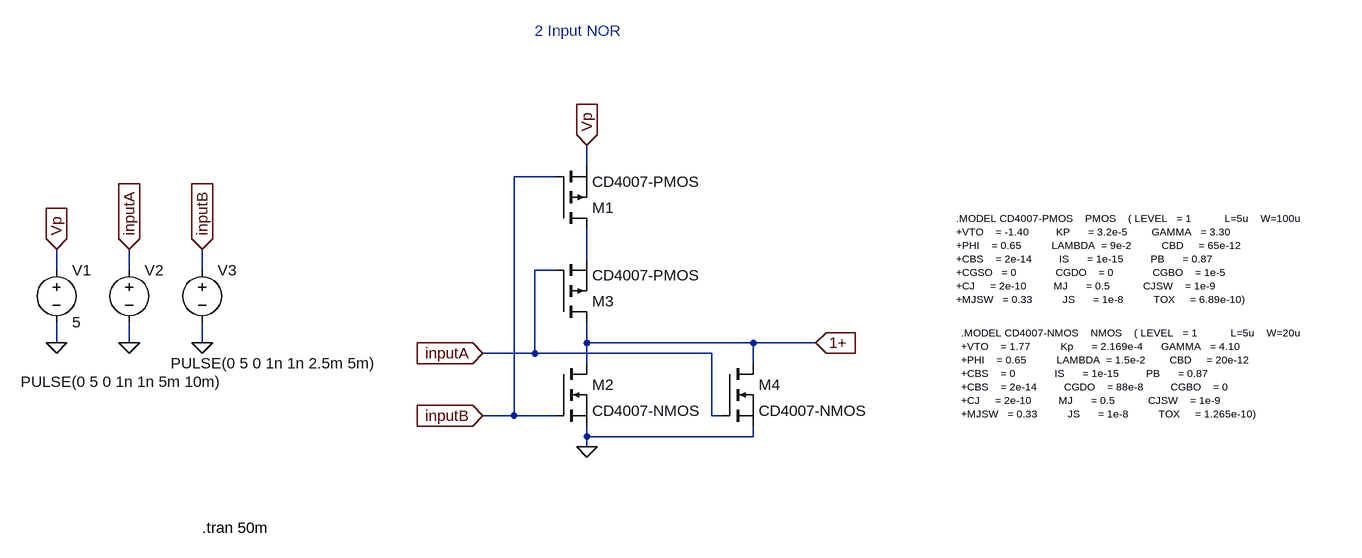
[diagram p0: schematic two_in_nor_ltspice.asc]
two_in_nor_ltspice.asc, the LTspice schematic file:
Version 4
SHEET 1 1176 680
WIRE -800 -128 -800 -160
WIRE -848 -112 -912 -112
WIRE -800 16 -800 -32
WIRE -1616 32 -1616 0
WIRE -1504 32 -1504 0
WIRE -1392 32 -1392 0
WIRE -848 32 -880 32
WIRE -1616 144 -1616 112
WIRE -1504 144 -1504 112
WIRE -1392 144 -1392 112
WIRE -800 144 -800 112
WIRE -544 144 -800 144
WIRE -448 144 -544 144
WIRE -880 160 -880 32
WIRE -880 160 -960 160
WIRE -608 160 -880 160
WIRE -800 176 -800 144
WIRE -544 176 -544 144
WIRE -912 256 -912 -112
WIRE -912 256 -960 256
WIRE -848 256 -912 256
WIRE -608 256 -608 160
WIRE -592 256 -608 256
WIRE -800 288 -800 272
WIRE -544 288 -544 272
WIRE -544 288 -800 288
WIRE -800 304 -800 288
FLAG -800 304 0
FLAG -960 160 inputA
IOPIN -960 160 In
FLAG -960 256 inputB
IOPIN -960 256 In
FLAG -1616 144 0
FLAG -1504 144 0
FLAG -1392 144 0
FLAG -1616 0 Vp
IOPIN -1616 0 In
FLAG -1504 0 inputA
IOPIN -1504 0 In
FLAG -1392 0 inputB
IOPIN -1392 0 In
FLAG -800 -160 Vp
IOPIN -800 -160 In
FLAG -448 144 1+
IOPIN -448 144 In
SYMBOL pmos -848 -32 M180
SYMATTR InstName M1
SYMATTR Value CD4007-PMOS
SYMBOL nmos -848 176 R0
SYMATTR InstName M2
SYMATTR Value CD4007-NMOS
SYMBOL pmos -848 112 M180
SYMATTR InstName M3
SYMATTR Value CD4007-PMOS
SYMBOL nmos -592 176 R0
SYMATTR InstName M4
SYMATTR Value CD4007-NMOS
SYMBOL voltage -1616 16 R0
WINDOW 123 0 0 Left 0
WINDOW 39 0 0 Left 0
SYMATTR InstName V1
SYMATTR Value 5
SYMBOL voltage -1504 16 R0
WINDOW 3 -167 188 Left 2
WINDOW 123 0 0 Left 0
WINDOW 39 0 0 Left 0
SYMATTR InstName V2
SYMATTR Value PULSE(0 5 0 1n 1n 5m 10m)
SYMBOL voltage -1392 16 R0
WINDOW 3 -48 159 Left 2
WINDOW 123 0 0 Left 0
WINDOW 39 0 0 Left 0
SYMATTR InstName V3
SYMATTR Value PULSE(0 5 0 1n 1n 2.5m 5m)
TEXT -232 -48 Left 1 !.MODEL CD4007-PMOS    PMOS    ( LEVEL   = 1           L=5u    W=100u                \n+VTO    = -1.40         KP      = 3.2e-5        GAMMA   = 3.30  \n+PHI    = 0.65          LAMBDA  = 9e-2          CBD     = 65e-12\n+CBS    = 2e-14         IS      = 1e-15         PB      = 0.87\n+CGSO   = 0             CGDO    = 0             CGBO    = 1e-5\n+CJ     = 2e-10         MJ      = 0.5           CJSW    = 1e-9\n+MJSW   = 0.33          JS      = 1e-8          TOX     = 6.89e-10)
TEXT -224 128 Left 1 !.MODEL CD4007-NMOS    NMOS    ( LEVEL   = 1           L=5u    W=20u             \n+VTO    = 1.77          Kp      = 2.169e-4      GAMMA   = 4.10  \n+PHI    = 0.65          LAMBDA  = 1.5e-2        CBD     = 20e-12\n+CBS    = 0             IS      = 1e-15         PB      = 0.87\n+CBS    = 2e-14         CGDO    = 88e-8         CGBO    = 0\n+CJ     = 2e-10         MJ      = 0.5           CJSW    = 1e-9\n+MJSW   = 0.33          JS      = 1e-8          TOX     = 1.265e-10)
TEXT -1392 428 Left 2 !.tran 50m
TEXT -880 -336 Left 2 ;2 Input NOR

The netlist it stands for:
* two_in_nor_ltspice.asc
M1 N001 inputB Vp Vp CD4007-PMOS
M2 1+ inputB 0 0 CD4007-NMOS
M3 1+ inputA N001 N001 CD4007-PMOS
M4 1+ inputA 0 0 CD4007-NMOS
V1 Vp 0 5
V2 inputA 0 PULSE(0 5 0 1n 1n 5m 10m)
V3 inputB 0 PULSE(0 5 0 1n 1n 2.5m 5m)
.model NMOS NMOS
.model PMOS PMOS
.lib standard.mos
.MODEL CD4007-PMOS    PMOS    ( LEVEL   = 1           L=5u    W=100u
+VTO    = -1.40         KP      = 3.2e-5        GAMMA   = 3.30
+PHI    = 0.65          LAMBDA  = 9e-2          CBD     = 65e-12
+CBS    = 2e-14         IS      = 1e-15         PB      = 0.87
+CGSO   = 0             CGDO    = 0             CGBO    = 1e-5
+CJ     = 2e-10         MJ      = 0.5           CJSW    = 1e-9
+MJSW   = 0.33          JS      = 1e-8          TOX     = 6.89e-10)
.MODEL CD4007-NMOS    NMOS    ( LEVEL   = 1           L=5u    W=20u
+VTO    = 1.77          Kp      = 2.169e-4      GAMMA   = 4.10
+PHI    = 0.65          LAMBDA  = 1.5e-2        CBD     = 20e-12
+CBS    = 0             IS      = 1e-15         PB      = 0.87
+CBS    = 2e-14         CGDO    = 88e-8         CGBO    = 0
+CJ     = 2e-10         MJ      = 0.5           CJSW    = 1e-9
+MJSW   = 0.33          JS      = 1e-8          TOX     = 1.265e-10)
.tran 50m
* 2 Input NOR
.backanno
.end